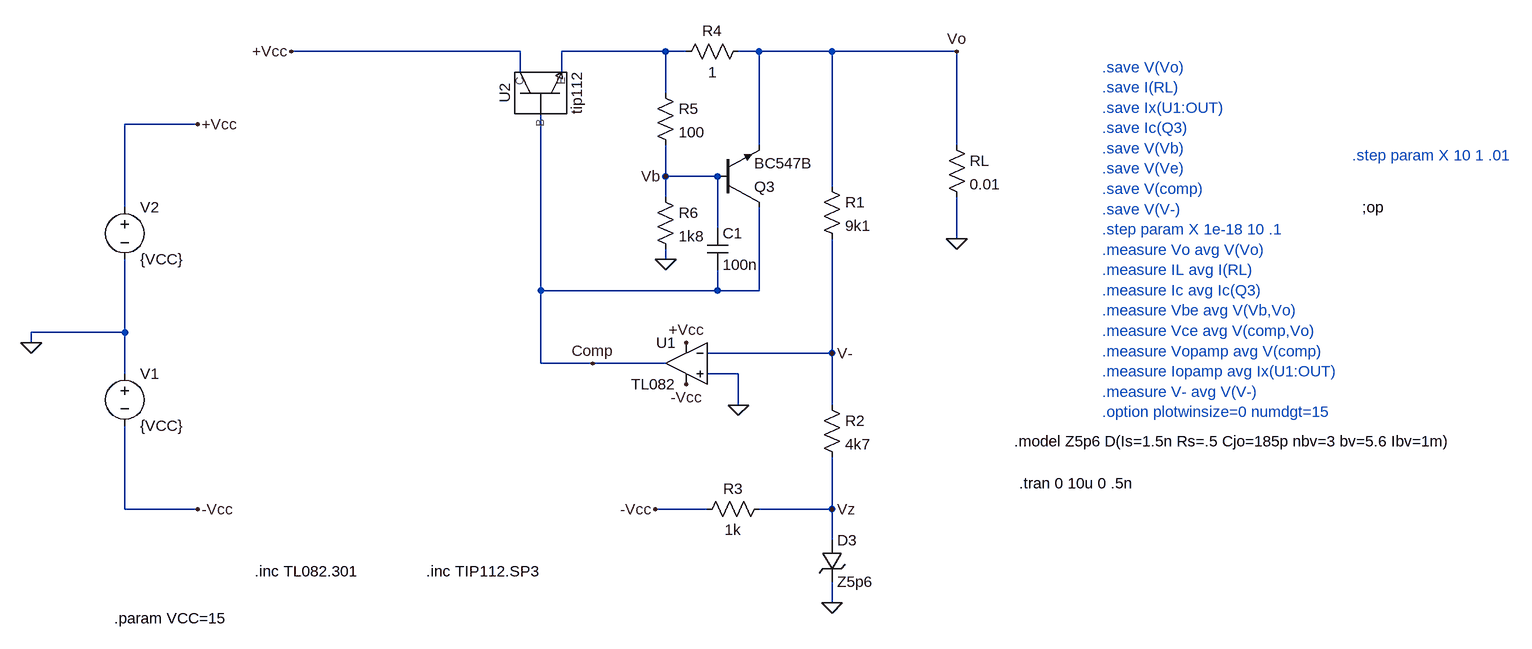
[diagram p0: schematic Fuente regulada.asc]
Fuente regulada.asc, the LTspice schematic file:
Version 4
SHEET 1 1840 1096
WIRE 224 -144 -128 -144
WIRE 448 -144 288 -144
WIRE 480 -144 448 -144
WIRE 592 -144 560 -144
WIRE 704 -144 592 -144
WIRE 896 -144 704 -144
WIRE 224 -112 224 -144
WIRE 288 -112 288 -144
WIRE 448 -80 448 -144
WIRE -272 -32 -384 -32
WIRE 592 0 592 -144
WIRE 896 0 896 -144
WIRE 448 48 448 0
WIRE 528 48 448 48
WIRE 704 64 704 -144
WIRE 448 80 448 48
WIRE -384 96 -384 -32
WIRE 528 128 528 48
WIRE 896 144 896 80
WIRE 448 176 448 160
WIRE 256 224 256 -48
WIRE 528 224 528 192
WIRE 528 224 256 224
WIRE 592 224 592 96
WIRE 592 224 528 224
WIRE -384 288 -384 176
WIRE -384 288 -528 288
WIRE -528 304 -528 288
WIRE 704 320 704 144
WIRE 704 320 512 320
WIRE 256 336 256 224
WIRE 336 336 256 336
WIRE 448 336 336 336
WIRE -384 352 -384 288
WIRE 560 352 512 352
WIRE 560 400 560 352
WIRE 704 400 704 320
WIRE -384 560 -384 432
WIRE -272 560 -384 560
WIRE 512 560 432 560
WIRE 704 560 704 480
WIRE 704 560 592 560
WIRE 704 608 704 560
WIRE 704 704 704 672
FLAG -528 304 0
FLAG 560 400 0
FLAG 704 704 0
FLAG 896 144 0
FLAG -272 -32 +Vcc
FLAG -128 -144 +Vcc
FLAG 432 560 -Vcc
FLAG -272 560 -Vcc
FLAG 896 -144 Vo
FLAG 704 560 Vz
FLAG 336 336 Comp
FLAG 704 320 V-
FLAG 448 176 0
FLAG 480 304 +Vcc
FLAG 480 368 -Vcc
FLAG 448 48 Vb
SYMBOL res 688 48 R0
SYMATTR InstName R1
SYMATTR Value 9k1
SYMBOL res 688 384 R0
SYMATTR InstName R2
SYMATTR Value 4k7
SYMBOL res 608 544 R90
WINDOW 0 0 56 VBottom 2
WINDOW 3 32 56 VTop 2
SYMATTR InstName R3
SYMATTR Value 1k
SYMBOL zener 688 608 R0
SYMATTR InstName D3
SYMATTR Value Z5p6
SYMBOL OpAmps\\opamp2 480 272 M0
SYMATTR InstName U1
SYMATTR Value TL082
SYMBOL voltage -384 336 R0
WINDOW 123 0 0 Left 0
WINDOW 39 0 0 Left 0
SYMATTR InstName V1
SYMATTR Value {VCC}
SYMBOL voltage -384 80 R0
WINDOW 123 0 0 Left 0
WINDOW 39 0 0 Left 0
SYMATTR InstName V2
SYMATTR Value {VCC}
SYMBOL res 880 -16 R0
SYMATTR InstName RL
SYMATTR Value 0.01
SYMBOL npn 528 96 M180
SYMATTR InstName Q3
SYMATTR Value BC547B
SYMBOL res 576 -160 R90
WINDOW 0 0 56 VBottom 2
WINDOW 3 32 56 VTop 2
SYMATTR InstName R4
SYMATTR Value 1
SYMBOL tip112 256 -80 R270
SYMATTR InstName U2
SYMBOL res 432 -96 R0
SYMATTR InstName R5
SYMATTR Value 100
SYMBOL res 432 64 R0
SYMATTR InstName R6
SYMATTR Value 1k8
SYMBOL cap 512 128 R0
SYMATTR InstName C1
SYMATTR Value 100n
TEXT -184 656 Left 2 !.inc TL082.301
TEXT 80 656 Left 2 !.inc TIP112.SP3
TEXT 984 456 Left 2 !.model Z5p6 D(Is=1.5n Rs=.5 Cjo=185p nbv=3 bv=5.6 Ibv=1m)
TEXT 1120 -120 Left 2 ;.save V(Vo)\n.save I(RL)\n.save Ix(U1:OUT)\n.save Ic(Q3)\n.save V(Vb)\n.save V(Ve)\n.save V(comp)\n.save V(V-)\n.step param X 1e-18 10 .1\n.measure Vo avg V(Vo)\n.measure IL avg I(RL)\n.measure Ic avg Ic(Q3)\n.measure Vbe avg V(Vb,Vo)\n.measure Vce avg V(comp,Vo)\n.measure Vopamp avg V(comp)\n.measure Iopamp avg Ix(U1:OUT)\n.measure V- avg V(V-)\n.option plotwinsize=0 numdgt=15
TEXT -400 728 Left 2 !.param VCC=15
TEXT 1504 16 Left 2 ;.step param X 10 1 .01
TEXT 1520 96 Left 2 !;op
TEXT 992 520 Left 2 !.tran 0 10u 0 .5n

The netlist it stands for:
* Fuente regulada.asc
R1 Vo V- 9k1
R2 V- Vz 4k7
R3 Vz -Vcc 1k
D3 Vz 0 Z5p6
XU1 0 V- +Vcc -Vcc Comp TL082  ; pins In+ In- V+ V- OUT
V1 0 -Vcc {VCC}
V2 +Vcc 0 {VCC}
RL Vo 0 0.01
Q3 Comp Vb Vo 0 BC547B
R4 Vo N001 1
XU2 +Vcc Comp N001 tip112  ; pins C B E
R5 N001 Vb 100
R6 Vb 0 1k8
C1 Vb Comp 100n
.model D D
.lib standard.dio
.model NPN NPN
.model PNP PNP
.lib standard.bjt
.inc TL082.301
.inc TIP112.SP3
.model Z5p6 D(Is=1.5n Rs=.5 Cjo=185p nbv=3 bv=5.6 Ibv=1m)
* .save V(Vo)
* .save I(RL)
* .save Ix(U1:OUT)
* .save Ic(Q3)
* .save V(Vb)
* .save V(Ve)
* .save V(comp)
* .save V(V-)
* .step param X 1e-18 10 .1
* .measure Vo avg V(Vo)
* .measure IL avg I(RL)
* .measure Ic avg Ic(Q3)
* .measure Vbe avg V(Vb,Vo)
* .measure Vce avg V(comp,Vo)
* .measure Vopamp avg V(comp)
* .measure Iopamp avg Ix(U1:OUT)
* .measure V- avg V(V-)
* .option plotwinsize=0 numdgt=15
.param VCC=15
* .step param X 10 1 .01
;op
.tran 0 10u 0 .5n
.lib TIP112.SP3
.backanno
.end